# EasyEDA Pro project ProPrj_agronet_2025-02-23.epro

# Schematic Schematic1
Board Name: Board1; Create Date: 2024-12-03; Page Name: P1; Project Name: agronet; Schematic Name: Schematic1; Update Date: 2024-12-12; Company: Roxcode; Drawn: Ulisses Maffazioli; Page Size: A4; Part Number: ROX-001; Reviewed: Ulisses Maffazioli; Version: V0.1
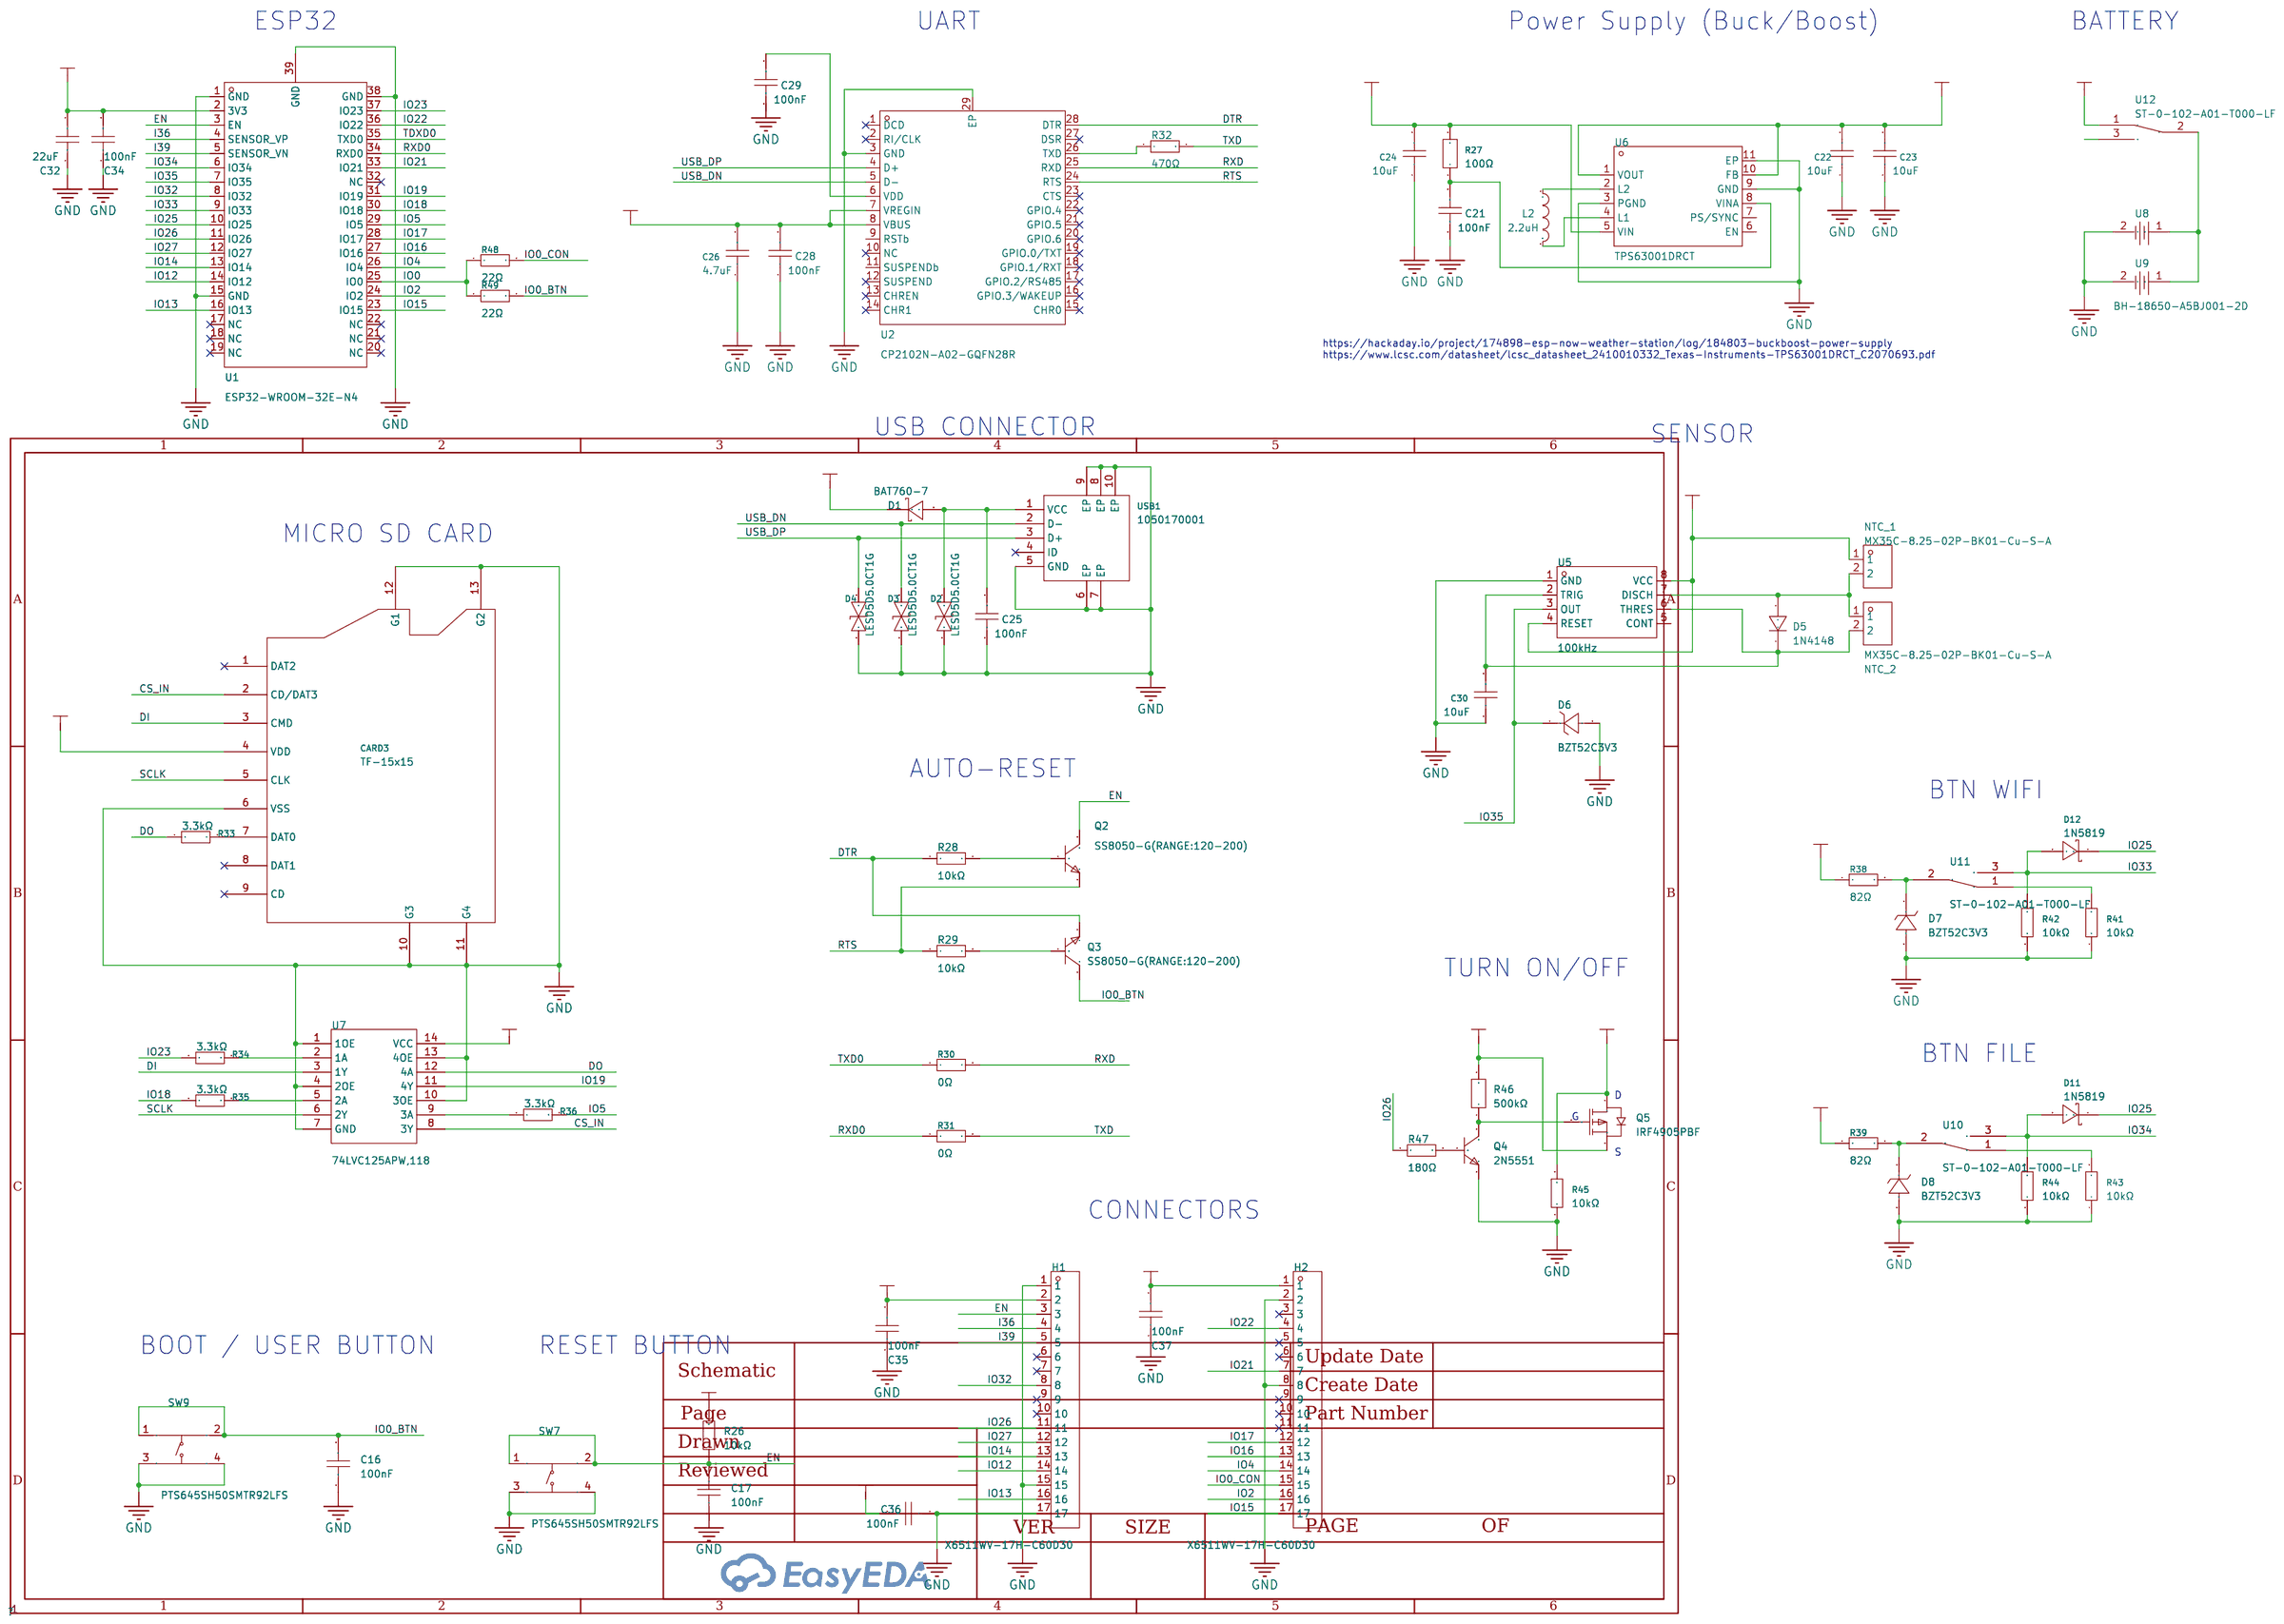
[diagram p0: schematic sheet]

## Parts
C16  100nF  [C0402]
C17  100nF  [C0402]
C21  100nF  [C0402]
C22  10uF  [C0603]
C23  10uF  [C0603]
C24  10uF  [C0603]
C25  100nF  [C0402]
C26  4.7uF  [C0402]
C28  100nF  [C0402]
C29  100nF  [C0402]
C30  10uF  [C0603]
C32  22uF  [C0805]
C34  100nF  [C0402]
C35  100nF  [C0402]
C36  100nF  [C0402]
C37  100nF  [C0402]
CARD3  TF-15x15  [TF-SMD_TF-15-15]
D1  BAT760-7  [SOD-323_L1.8-W1.3-LS2.5-RD]
D2  LESD5D5.0CT1G  [SOD-523_L1.2-W0.8-LS1.6-BI]
D3  LESD5D5.0CT1G  [SOD-523_L1.2-W0.8-LS1.6-BI]
D4  LESD5D5.0CT1G  [SOD-523_L1.2-W0.8-LS1.6-BI]
D5  1N4148  [DO-35_BD2.0-L4.0-P8.0-D0.5-RD]
D6  BZT52C3V3  [SOD-123_L2.7-W1.6-LS3.7-RD]
D7  BZT52C3V3  [SOD-123_L2.7-W1.6-LS3.7-RD]
D8  BZT52C3V3  [SOD-123_L2.7-W1.6-LS3.7-RD]
D11  1N5819  [DO-41_BD2.4-L4.7-P8.70-D0.9-RD]
D12  1N5819  [DO-41_BD2.4-L4.7-P8.70-D0.9-RD]
H1  X6511WV-17H-C60D30  [HDR-TH_17P-P2.54-V-M]
H2  X6511WV-17H-C60D30  [HDR-TH_17P-P2.54-V-M]
L2  2.2uH  [L1008]
NTC_1  MX35C-8.25-02P-BK01-Cu-S-A  [CONN-TH_MX35C-8.25-02P-BK01-CU-S-A]
NTC_2  MX35C-8.25-02P-BK01-Cu-S-A  [CONN-TH_MX35C-8.25-02P-BK01-CU-S-A]
Q2  SS8050-G(RANGE:120-200)  [SOT-23-3_L2.9-W1.3-P1.90-LS2.4-BR]
Q3  SS8050-G(RANGE:120-200)  [SOT-23-3_L2.9-W1.3-P1.90-LS2.4-BR]
Q4  2N5551  [TO-92-3_L4.5-W3.5-P1.27-L]
Q5  IRF4905PBF  [TO-220-3_L10.0-W4.5-P2.54-T]
R26  10kΩ  [R0402]
R27  100Ω  [R0402]
R28  10kΩ  [R0402]
R29  10kΩ  [R0402]
R30  0Ω  [R0402]
R31  0Ω  [R0402]
R32  470Ω  [R0603]
R33  3.3kΩ  [R0402]
R34  3.3kΩ  [R0402]
R35  3.3kΩ  [R0402]
R36  3.3kΩ  [R0402]
R38  82Ω  [R0402]
R39  82Ω  [R0402]
R41  10kΩ  [R0805]
R42  10kΩ  [R0805]
R43  10kΩ  [R0805]
R44  10kΩ  [R0805]
R45  10kΩ  [R0805]
R46  500kΩ  [R0603]
R47  180Ω  [R0603]
R48  22Ω  [R0402]
R49  22Ω  [R0402]
SW7  PTS645SH50SMTR92LFS  [KEY-SMD_4P-L6.0-W6.0-P4.50-LS9.0]
SW9  PTS645SH50SMTR92LFS  [KEY-SMD_4P-L6.0-W6.0-P4.50-LS9.0]
U1  ESP32-WROOM-32E-N4  [WIFI-SMD_ESP32-WROOM-32E]
U2  CP2102N-A02-GQFN28R  [QFN-28_L5.0-W5.0-P0.50-TL-EP3.3]
U5  100kHz  [DIP-8_L9.8-W6.6-P2.54-LS7.6-BL]
U6  TPS63001DRCT  [VSON-10_L3.0-W3.0-P0.50-TL-EP]
U7  74LVC125APW,118  [TSSOP-14_L5.0-W4.4-P0.65-LS6.4-BL]
U8  BH-18650-A5BJ001-2D  [BAT-TH_BH-18650-A5BJ001-2D]
U9  BH-18650-A5BJ001-2D  [BAT-TH_BH-18650-A5BJ001-2D]
U10  ST-0-102-A01-T000-LF  [SW-TH_3P-L8.3-W5.2-P2.54_ST-0-102-A01-T000]
U11  ST-0-102-A01-T000-LF  [SW-TH_3P-L8.3-W5.2-P2.54_ST-0-102-A01-T000]
U12  ST-0-102-A01-T000-LF  [SW-TH_3P-L8.3-W5.2-P2.54_ST-0-102-A01-T000]
USB1  1050170001  [MICRO-USB-SMD_105017-0001]

## Library data of the parts
C16 C17 C21 C25 C28 C29 C34-C37 = CL05B104KO5NNNC: Capacitance: Tolerance:±10% Tolerance:±10% Voltage Rated: Temperature Coefficient:; LCSC Part Name: 100nF ±10% 16V; Supplier Part: C1525; Manufacturer: SAMSUNG(三星); Supplier Footprint: 0402; JLCPCB Part Class: Basic Part; Datasheet: https://atta.szlcsc.com/upload/public/pdf/source/20160218/1457707763339.pdf; Supplier: LCSC; Tolerance: ±10%
C22-C24 C30 = CL10A106MQ8NNNC: Capacitance: Tolerance:±20% Tolerance:±20% Voltage Rated: Temperature Coefficient:; LCSC Part Name: 10uF ±20% 6.3V; Supplier Part: C1691; Manufacturer: SAMSUNG(三星); Supplier Footprint: 0603; JLCPCB Part Class: Extended Part; Datasheet: https://atta.szlcsc.com/upload/public/pdf/source/20160218/1457707763339.pdf; Supplier: LCSC; Tolerance: ±20%
C26 = CL05A475KP5NRNC: Capacitance: Tolerance:±10% Tolerance:±10% Voltage Rated: Temperature Coefficient:; LCSC Part Name: 4.7uF ±10% 10V; Supplier Part: C368809; Manufacturer: SAMSUNG(三星); Supplier Footprint: 0402; Datasheet: https://atta.szlcsc.com/upload/public/pdf/source/20160218/1457707763339.pdf; Supplier: LCSC; Tolerance: ±10%
C32 = CL21A226MAYNNNE: Capacitance: Tolerance:±20% Tolerance:±20% Voltage Rated: Temperature Coefficient:; LCSC Part Name: 22uF ±20% 25V; Supplier Part: C602037; Manufacturer: SAMSUNG(三星); Supplier Footprint: 0805; Datasheet: https://atta.szlcsc.com/upload/public/pdf/source/20200609/C602037_1A0D619693E608A1BF6E80154254E2DB.pdf; Supplier: LCSC; Tolerance: ±20%
CARD3 = TF-15x15: Card Connection Mode:Self bomb Card Type:MicroSD卡(TF卡) Connector Type:Deck Maximum Body Height:- Contact Material:- Contact Plating:- Operating Temperature Range:- Operating Temperature Range:- Soldering Temperature(Max):-; LCSC Part Name: 自弹式 MicroSD卡(TF卡) 卡座; Supplier Part: C111196; Manufacturer: SOFNG(硕方); Supplier Footprint: SMD; Datasheet: https://atta.szlcsc.com/upload/public/pdf/source/20200911/C111196_6985EA70490FD8F56A5C3F4D017F3786.pdf; Supplier: LCSC; Card Connection Mode: Self bomb; Card Type: MicroSD卡(TF卡); Connector Type: Deck
D1 = BAT760-7: Forward Voltage (Vf@If):550mV@1A Reverse Voltage (Vr):30V Rectified Current:1A Reverse Leakage Current (Ir):50uA@15V; LCSC Part Name: 电压:30V 电流:1A; Supplier Part: C124187; Manufacturer: DIODES(美台); Supplier Footprint: SOD-323; Datasheet: https://atta.szlcsc.com/upload/public/pdf/source/20171023/C124187_15087452555971052319.pdf; Supplier: LCSC; Forward Voltage (Vf@If): 550mV@1A; Reverse Voltage (Vr): 30V; Rectified Current: 1A; Reverse Leakage Current (Ir): 50uA@15V
D2-D4 = LESD5D5.0CT1G: polarity:Bi-Directional Reverse Stand-Off Voltage (Vrwm):5V Maximum Clamping Voltage:18.6V Peak Pulse Current (Ipp)@10/1000us:9.4A Breakdown Voltage:5.6V Type:ESD; LCSC Part Name: 双向ESD; Supplier Part: C383211; Manufacturer: LRC(乐山无线电); Supplier Footprint: SOD-523; JLCPCB Part Class: Extended Part; Datasheet: https://atta.szlcsc.com/upload/public/pdf/source/20190807/C383211_633DF4B4E2C161403226E5235FE33A1C.pdf; Supplier: LCSC; polarity: Bi-Directional; Reverse Stand-Off Voltage (Vrwm): 5V; Maximum Clamping Voltage: 18.6V; Peak Pulse Current (Ipp)@10/1000us: 9.4A; Breakdown Voltage: 5.6V; Type: ESD
D5 = 1N4148: Diode Configuration: Forward Voltage (Vf@If):- Reverse Voltage (Vr):- Average Rectified Current (Io):- Reverse Leakage Current:-; Supplier Part: C13769; Supplier Footprint: DO-35; Supplier: LCSC
D6-D8 = BZT52C3V3_1: Zener Voltage (Nom):3.3V Power Dissipation:350mW; Supplier Part: C5805693; Manufacturer: XZT(信展通); Supplier Footprint: SOD-123; JLCPCB Part Class: Extended Part; Datasheet: https://atta.szlcsc.com/upload/public/pdf/source/20230629/5B797ABAA38694813CD10E892227B1D3.pdf; Supplier: LCSC; Zener Voltage (Nom): 3.3V; Power Dissipation: 350mW
D11 D12 = 1N5819_C84620: Forward Voltage (Vf@If):600mV@1A Reverse Voltage (Vr):40V Average Rectified Current (Io):1A; LCSC Part Name: 电压:40V 电流:1A; Supplier Part: C84620; Manufacturer: 星海; Supplier Footprint: DO-41; JLCPCB Part Class: Extended Part; Datasheet: https://atta.szlcsc.com/upload/public/pdf/source/20161024/1477288663382.pdf; Supplier: LCSC; Forward Voltage (Vf@If): 600mV@1A; Reverse Voltage (Vr): 40V; Average Rectified Current (Io): 1A
H1 H2 = X6511WV-17H-C60D30: Pin Structure:1x17P Pitch:2.54mm Row Spacing:2.54mm Circluar Pins/Square Pins:Square Pins Mounting Type:- Number of Rows:Plugin Number of Pins:17P Current Rating (Max):3A Voltage Rating (Max):250V Length of Mating Pin:- Insulation Height:2.5mm Length of E; LCSC Part Name: 1x17P 间距:2.54mm 方针; Supplier Part: C725949; Manufacturer: XKB Connection(中国星坤); Supplier Footprint: 插件,P=2.54mm; JLCPCB Part Class: Extended Part; Datasheet: https://atta.szlcsc.com/upload/public/pdf/source/20211009/D19569EFFEB9776B42364DF7D41FD96A.pdf; Supplier: LCSC; Pin Structure: 1x17P; Pitch: 2.54mm; Row Spacing: 2.54mm; Circluar Pins/Square Pins: Square Pins; Number of Rows: Plugin; Number of Pins: 17P; Current Rating (Max): 3A; Voltage Rating (Max): 250V; Insulation Height: 2.5mm; Contact Plating: Gold; Operating Temperature Range: -40℃~+105℃; Soldering Temperature(Max): 260℃; Color: Black
L2 = LQM2HPN2R2MG0L: Inductance: Tolerance:±20% Tolerance:±20% Rated Current: Saturation Current (Isat):- DC Resistance (DCR): Q @ Freq:- Frequency - Self Resonant: Ratings:; LCSC Part Name: 2.2uH ±20%; Supplier Part: C86092; Manufacturer: muRata(村田); Supplier Footprint: 1008; Datasheet: https://atta.szlcsc.com/upload/public/pdf/source/20180326/C86092_9C29A1E2AA95AB1022CF7FBF5DEEB894.pdf; Supplier: LCSC; Tolerance: ±20%
NTC_1 NTC_2 = MX35C-8.25-02P-BK01-Cu-S-A: Barrier Type:Double-sided Pitch:8.25mm Structure:1x2P Mounting Style:Straight Needle Pin Location:Mid Leg Number of Pins:2P Number of Rows:1 Number of PINs Per Row:2 Screw Specification:M3 Current Rating (Max):20A Voltage Rating (Max):300V Wire Gauge - AW; LCSC Part Name: 8.25mm 1x2P 直针 中脚 排数:1 每排P数:2; Supplier Part: C5290385; Manufacturer: MAX(迈旭); Supplier Footprint: 插件,P=8.25mm; JLCPCB Part Class: Extended Part; Datasheet: https://atta.szlcsc.com/upload/public/pdf/source/20230914/8F462108BB3B701A6F52F73F1C3AF090.pdf; Supplier: LCSC; Barrier Type: Double-sided; Pitch: 8.25mm; Structure: 1x2P; Mounting Style: Straight Needle; Pin Location: Mid Leg; Number of Pins: 2P; Number of Rows: 1; Number of PINs Per Row: 2; Screw Specification: M3; Current Rating (Max): 20A; Voltage Rating (Max): 300V; Wire Gauge - AWG: 12~22; Wire Gauge - mm2: 2.5; Operating Temperature Range: -40℃~+105℃; Color: Black
Q2 Q3 = SS8050-G(RANGE:120-200): Transistor Type: Collector Current (Ic): Collector-Emitter Breakdown Voltage (Vceo): Power Dissipation (Pd): DC Current Gain (hFE@Ic,Vce):120@100mA,1V DC Current Gain (hFE@Ic,Vce):120@100mA,1V Transition Frequency (fT):100MHz Collector Cut-Off Current (Ic; LCSC Part Name: NPN 电流:1.5A 耐压:25V L档(120-200); Supplier Part: C164886; Manufacturer: CJ(江苏长电/长晶); Supplier Footprint: SOT-23; JLCPCB Part Class: Extended Part; Datasheet: https://atta.szlcsc.com/upload/public/pdf/source/20180130/C177739_15172974524031323483.pdf; Supplier: LCSC; DC Current Gain (hFE@Ic,Vce): 120@100mA,1V; Transition Frequency (fT): 100MHz; Collector Cut-Off Current (Icbo): 100nA; Collector-Emitter Saturation Voltage (VCE(sat)@Ic,Ib): 500mV@800mA,80mA; Operating Temperature: -55℃~+150℃
Q4 = 2N5551: Transistor Type: Collector Current (Ic):600mA Collector-Emitter Breakdown Voltage (Vceo): Power Dissipation (Pd): DC Current Gain (hFE@Ic,Vce):80@10mA,5V DC Current Gain (hFE@Ic,Vce):80@10mA,5V Transition Frequency (fT):100MHz Collector Cut-Off Current (I; LCSC Part Name: NPN 电流:600mA 耐压:160V; Supplier Part: C2936034; Manufacturer: Slkor(萨科微); Supplier Footprint: TO-92-3; Datasheet: https://atta.szlcsc.com/upload/public/pdf/source/20211223/6A0B10C6CED69DC3DE22C5E0F389F525.pdf; Supplier: LCSC; Collector Current (Ic): 600mA; DC Current Gain (hFE@Ic,Vce): 80@10mA,5V; Transition Frequency (fT): 100MHz; Collector Cut-Off Current (Icbo): 50nA; Collector-Emitter Saturation Voltage (VCE(sat)@Ic,Ib): 200mV@50mA,5mA
Q5 = IRF4905PBF: Type:1 Piece P-Channel Drain Source Voltage (Vdss): Continuous Drain Current (Id): Drain Source On Resistance (RDS(on)@Vgs,Id):0.02Ω@10V,38A Power Dissipation (Pd): Gate Threshold Voltage (Vgs(th)@Id):2V@250uA Total Gate Charge (Qg@Vgs):180nC@10V Input Ca; LCSC Part Name: 1个P沟道 耐压:55V 电流:74A; Supplier Part: C2564; Manufacturer: Infineon(英飞凌); Supplier Footprint: TO-220AB; JLCPCB Part Class: Extended Part; Datasheet: https://atta.szlcsc.com/upload/public/pdf/source/20140818/1457707225921.pdf; Supplier: LCSC; Type: 1 Piece P-Channel; Drain Source On Resistance (RDS(on)@Vgs,Id): 0.02Ω@10V,38A; Gate Threshold Voltage (Vgs(th)@Id): 2V@250uA; Total Gate Charge (Qg@Vgs): 180nC@10V; Input Capacitance (Ciss@Vds): 3.4nF; Reverse Transfer Capacitance (Crss@Vds): 640pF; Operating Temperature: -55℃~+175℃
R26 R28 R29 = 0402WGF1002TCE: Type:Thick Film Resistors Resistance:10kΩ Tolerance:±1% Tolerance:±1% Power(Watts): Overload Voltage (Max): Temperature Coefficient:±100ppm/℃ Temperature Coefficient:±100ppm/℃ Operating Temperature Range:-55℃~+155℃ Operating Temperature Range:-55℃~+155℃; LCSC Part Name: 10kΩ ±1% 62.5mW 厚膜电阻; Supplier Part: C25744; Manufacturer: UNI-ROYAL(厚声); Supplier Footprint: 0402; JLCPCB Part Class: Basic Part; Datasheet: https://atta.szlcsc.com/upload/public/pdf/source/20200306/C422600_1E6D84923E4A46A82E41ADD87F860B5C.pdf; Supplier: LCSC; Type: Thick Film Resistors; Tolerance: ±1%; Temperature Coefficient: ±100ppm/℃; Operating Temperature Range: -55℃~+155℃
R27 = TC0250B1000TCC: Type:Thin Film Resistor Resistance: Tolerance:±0.1% Tolerance:±0.1% Power(Watts): Overload Voltage (Max): Temperature Coefficient:±50ppm/℃ Temperature Coefficient:±50ppm/℃; LCSC Part Name: 100Ω ±0.1% 62.5mW 薄膜电阻; Supplier Part: C517517; Manufacturer: UNI-ROYAL(厚声); Supplier Footprint: 0402; JLCPCB Part Class: Extended Part; Datasheet: https://atta.szlcsc.com/upload/public/pdf/source/20200423/C516826_F020E15F12DC1CC4D2066749A2400ECB.pdf; Supplier: LCSC; Type: Thin Film Resistor; Tolerance: ±0.1%; Temperature Coefficient: ±50ppm/℃
R30 R31 = 0402WGF0000TCE: Type:Thick Film Resistors Resistance: Tolerance:±1% Tolerance:±1% Power(Watts): Overload Voltage (Max): Temperature Coefficient:±800ppm/℃ Temperature Coefficient:±800ppm/℃ Operating Temperature Range:-55℃~+155℃ Operating Temperature Range:-55℃~+155℃; LCSC Part Name: 0Ω ±1% 62.5mW 厚膜电阻; Supplier Part: C17168; Manufacturer: UNI-ROYAL(厚声); Supplier Footprint: 0402; JLCPCB Part Class: Basic Part; Datasheet: https://atta.szlcsc.com/upload/public/pdf/source/20200306/C422600_1E6D84923E4A46A82E41ADD87F860B5C.pdf; Supplier: LCSC; Type: Thick Film Resistors; Tolerance: ±1%; Temperature Coefficient: ±800ppm/℃; Operating Temperature Range: -55℃~+155℃
R32 = 0603WAF4700T5E: Type:Thick Film Resistors Resistance: Tolerance:±1% Tolerance:±1% Power(Watts): Overload Voltage (Max): Temperature Coefficient:±100ppm/℃ Temperature Coefficient:±100ppm/℃ Operating Temperature Range:-55℃~+155℃ Operating Temperature Range:-55℃~+155℃; LCSC Part Name: 470Ω ±1% 100mW 厚膜电阻; Supplier Part: C23179; Manufacturer: UNI-ROYAL(厚声); Supplier Footprint: 0603; Datasheet: https://atta.szlcsc.com/upload/public/pdf/source/20200306/C422600_1E6D84923E4A46A82E41ADD87F860B5C.pdf; Supplier: LCSC; Type: Thick Film Resistors; Tolerance: ±1%; Temperature Coefficient: ±100ppm/℃; Operating Temperature Range: -55℃~+155℃
R33-R36 = 0402WGF3301TCE: Type:Thick Film Resistors Resistance:3.3kΩ Tolerance:±1% Tolerance:±1% Power(Watts): Overload Voltage (Max): Temperature Coefficient:±100ppm/℃ Temperature Coefficient:±100ppm/℃ Operating Temperature Range:-55℃~+155℃ Operating Temperature Range:-55℃~+155℃; LCSC Part Name: 3.3kΩ ±1% 62.5mW 厚膜电阻; Supplier Part: C25890; Manufacturer: UNI-ROYAL(厚声); Supplier Footprint: 0402; Datasheet: https://atta.szlcsc.com/upload/public/pdf/source/20200306/C422600_1E6D84923E4A46A82E41ADD87F860B5C.pdf; Supplier: LCSC; Type: Thick Film Resistors; Tolerance: ±1%; Temperature Coefficient: ±100ppm/℃; Operating Temperature Range: -55℃~+155℃
R38 R39 = 0402WGF820JTCE: Type:Thick Film Resistors Resistance:82Ω Tolerance:±1% Tolerance:±1% Power(Watts): Overload Voltage (Max): Temperature Coefficient:±200ppm/℃ Temperature Coefficient:±200ppm/℃ Operating Temperature Range:-55℃~+155℃ Operating Temperature Range:-55℃~+155℃; LCSC Part Name: 82Ω ±1% 62.5mW 厚膜电阻; Supplier Part: C25136; Manufacturer: UNI-ROYAL(厚声); Supplier Footprint: 0402; JLCPCB Part Class: Extended Part; Datasheet: https://atta.szlcsc.com/upload/public/pdf/source/20200306/C422600_1E6D84923E4A46A82E41ADD87F860B5C.pdf; Supplier: LCSC; Type: Thick Film Resistors; Tolerance: ±1%; Temperature Coefficient: ±200ppm/℃; Operating Temperature Range: -55℃~+155℃
R41-R45 = 0805W8F1002T5E: Type:Thick Film Resistors Resistance:10kΩ Tolerance:±1% Tolerance:±1% Power(Watts): Overload Voltage (Max): Temperature Coefficient:±100ppm/℃ Temperature Coefficient:±100ppm/℃ Operating Temperature Range:-55℃~+155℃ Operating Temperature Range:-55℃~+155℃; LCSC Part Name: 10kΩ ±1% 125mW 厚膜电阻; Supplier Part: C17414; Manufacturer: UNI-ROYAL(厚声); Supplier Footprint: 0805; Datasheet: https://atta.szlcsc.com/upload/public/pdf/source/20200306/C422600_1E6D84923E4A46A82E41ADD87F860B5C.pdf; Supplier: LCSC; Type: Thick Film Resistors; Tolerance: ±1%; Temperature Coefficient: ±100ppm/℃; Operating Temperature Range: -55℃~+155℃
R46 = AR03BTCX5003N: Type:Thin Film Resistor Resistance: Tolerance:±0.1% Tolerance:±0.1% Power(Watts): Overload Voltage (Max): Temperature Coefficient:±25ppm/℃ Temperature Coefficient:±25ppm/℃ Operating Temperature Range:-55℃~+155℃ Operating Temperature Range:-55℃~+155℃; LCSC Part Name: 薄膜电阻 500kΩ ±0.1% 100mW; Supplier Part: C2902631; Manufacturer: Viking(光颉); Supplier Footprint: 0603; Datasheet: https://atta.szlcsc.com/upload/public/pdf/source/20191129/C465721_10D49275DB41E427863CE9C8D788770A.pdf; Supplier: LCSC; Type: Thin Film Resistor; Tolerance: ±0.1%; Temperature Coefficient: ±25ppm/℃; Operating Temperature Range: -55℃~+155℃
R47 = 0603WAF1800T5E: Type:Thick Film Resistors Resistance: Tolerance:±1% Tolerance:±1% Power(Watts): Overload Voltage (Max): Temperature Coefficient:±100ppm/℃ Temperature Coefficient:±100ppm/℃ Operating Temperature Range:-55℃~+155℃ Operating Temperature Range:-55℃~+155℃; LCSC Part Name: 180Ω ±1% 100mW 厚膜电阻; Supplier Part: C22828; Manufacturer: UNI-ROYAL(厚声); Supplier Footprint: 0603; Datasheet: https://atta.szlcsc.com/upload/public/pdf/source/20200306/C422600_1E6D84923E4A46A82E41ADD87F860B5C.pdf; Supplier: LCSC; Type: Thick Film Resistors; Tolerance: ±1%; Temperature Coefficient: ±100ppm/℃; Operating Temperature Range: -55℃~+155℃
R48 R49 = 0402WGF220JTCE: Type:Thick Film Resistors Resistance:22Ω Tolerance:±1% Tolerance:±1% Power(Watts): Overload Voltage (Max): Temperature Coefficient:±100ppm/℃ Temperature Coefficient:±100ppm/℃ Operating Temperature Range:-55℃~+155℃ Operating Temperature Range:-55℃~+155℃; LCSC Part Name: 22Ω ±1% 62.5mW 厚膜电阻; Supplier Part: C25092; Manufacturer: UNI-ROYAL(厚声); Supplier Footprint: 0402; Datasheet: https://atta.szlcsc.com/upload/public/pdf/source/20200306/C422600_1E6D84923E4A46A82E41ADD87F860B5C.pdf; Supplier: LCSC; Type: Thick Film Resistors; Tolerance: ±1%; Temperature Coefficient: ±100ppm/℃; Operating Temperature Range: -55℃~+155℃
SW7 SW9 = PTS645SH50SMTR92LFS: Circuit:SPST Actuator Style:Round Button Operating Force:200gf Mounting Style:Standing paste Switch Length:6mm Switch Width:6mm Switch Height:5mm Contact Current:50mA Voltage Rating (DC):12V With Lamp:- Pin Style:Gullwing Mechanical Life:- Operating Tempe; LCSC Part Name: 6*6*5mm 立贴 轻触开关; Supplier Part: C221869; Manufacturer: C&K; Supplier Footprint: SMD,6x6mm; JLCPCB Part Class: Extended Part; Datasheet: https://atta.szlcsc.com/upload/public/pdf/source/20190108/C285530_E89B379DE8DD14E424006A6061D0203A.pdf; Supplier: LCSC; Circuit: SPST; Actuator Style: Round Button; Operating Force: 200gf; Mounting Style: Standing paste; Switch Length: 6mm; Switch Width: 6mm; Switch Height: 5mm; Contact Current: 50mA; Voltage Rating (DC): 12V; Pin Style: Gullwing; Operating Temperature: -40℃~+85℃
U1 = ESP32-WROOM-32E-N4: LCSC Part Name: 通用型Wi-Fi+BT+BLE MCU模组; Supplier Part: C701341; Manufacturer: ESPRESSIF(乐鑫); Supplier Footprint: SMD,18x25.5mm; Datasheet: https://atta.szlcsc.com/upload/public/pdf/source/20220601/0020821B65DE5740BBACA5FACC5CF3B6.pdf; Supplier: LCSC
U2 = CP2102N-A02-GQFN28R: Applications Function:USB to UART Protocol: Supply Voltage:3V~3.6V Supply Voltage:3V~3.6V Operating Temperature:-40℃~+85℃@(Ta) Operating Temperature:-40℃~+85℃@(Ta); LCSC Part Name: USB 2.0全速功能控制器，USB收发器，振荡器和通用异步接收机/发射机(UART); Supplier Part: C964632; Manufacturer: SKYWORKS/SILICON LABS(芯科); Supplier Footprint: QFN-28-EP(5x5); JLCPCB Part Class: Extended Part; Datasheet: https://atta.szlcsc.com/upload/public/pdf/source/20201204/C964632_F2B790CC23A72455AEF523510305B30A.pdf; Supplier: LCSC; Applications Function: USB to UART; Supply Voltage: 3V~3.6V; Operating Temperature: -40℃~+85℃@(Ta)
U5 = NE555P: Frequency:100kHz Supply Voltage:4.5V~16V Supply Voltage:4.5V~16V Supply Current:10mA Operating Temperature:0℃~+70℃ Operating Temperature:0℃~+70℃; Supplier Part: C46749; Manufacturer: TI(德州仪器); Supplier Footprint: DIP-8; Datasheet: https://www.ti.com/cn/lit/gpn/ne555; Supplier: LCSC; Supply Voltage: 4.5V~16V; Supply Current: 10mA; Operating Temperature: 0℃~+70℃
U6 = TPS63001DRCT: Function:Boost type Output Type:Fixed Input Voltage:1.8V~5.5V Input Voltage:1.8V~5.5V Output Voltage:3.3V Output Voltage:3.3V Output Current:1.6A Switching Frequency:1.5MHz Switching Frequency:1.5MHz Operating Temperature:-40℃~+85℃@(TA) Operating Temperat; LCSC Part Name: TPS6300x 高效单电感降压-升压转换器; Supplier Part: C2070693; Manufacturer: TI(德州仪器); Supplier Footprint: VSON-10-EP(3x3); JLCPCB Part Class: Extended Part; Datasheet: https://www.ti.com/cn/lit/gpn/tps63000; Supplier: LCSC; Function: Boost type; Output Type: Fixed; Input Voltage: 1.8V~5.5V; Output Voltage: 3.3V; Output Current: 1.6A; Switching Frequency: 1.5MHz; Operating Temperature: -40℃~+85℃@(TA); Synchronous Rectification: Yes; Number of Outputs: 1; Topology: Step-down-Boost; Switch tube (built-in/external): Built-in
U7 = 74LVC125APW,118: output type:Tri-State Supply Voltage:1.2V~3.6V Supply Voltage:1.2V~3.6V Number of Elements:4 Number of Bits per Element:1 Sink Current:24mA Source Current:24mA Logic Family:74LVC Operating Temperature:-40℃~+125℃ Operating Temperature:-40℃~+125℃; Supplier Part: C6059; Manufacturer: Nexperia(安世); Supplier Footprint: TSSOP-14; JLCPCB Part Class: Extended Part; Datasheet: https://atta.szlcsc.com/upload/public/pdf/source/20200702/C548083_7401241EC414E68B7416871F88F0FD1D.pdf; Supplier: LCSC; output type: Tri-State; Supply Voltage: 1.2V~3.6V; Number of Elements: 4; Number of Bits per Element: 1; Sink Current: 24mA; Source Current: 24mA; Logic Family: 74LVC; Operating Temperature: -40℃~+125℃
U8 U9 = BH-18650-A5BJ001-2D: Connector Type:Battery box Battery Type:- Contact Plating:Nickel Operating Temperature Range:-10℃~+100℃ Operating Temperature Range:-10℃~+100℃; LCSC Part Name: 电池盒; Supplier Part: C19184083; Manufacturer: MYOUNG(美阳); Supplier Footprint: 插件; JLCPCB Part Class: Extended Part; Datasheet: https://atta.szlcsc.com/upload/public/pdf/source/20231108/7CF586EC5DCFE5D582991176466319C5.pdf; Supplier: LCSC; Connector Type: Battery box; Contact Plating: Nickel; Operating Temperature Range: -10℃~+100℃
U10-U12 = ST-0-102-A01-T000-LF: Circuit:SPDT Switch Length:8.3mm Switch Width:5.2mm Switch Height:23.6mm Mechanical Life:- Contact Current:3A Voltage Rating (AC):125V Actuator Type:Cylindrical button handle Pin Style:Solder Lug Mounting Style:Straight Operating Temperature:-25℃~+85℃ Ope; LCSC Part Name: 超小型钮子三脚二档 五件套 含配件; Supplier Part: C1788487; Manufacturer: YUEN FUNG(源丰); Supplier Footprint: 插件; JLCPCB Part Class: Extended Part; Datasheet: https://atta.szlcsc.com/upload/public/pdf/source/20230720/31DDFEC61AC21D005BE18E754C3E93F0.pdf; Supplier: LCSC; Circuit: SPDT; Switch Length: 8.3mm; Switch Width: 5.2mm; Switch Height: 23.6mm; Contact Current: 3A; Voltage Rating (AC): 125V; Actuator Type: Cylindrical button handle; Pin Style: Solder Lug; Mounting Style: Straight; Operating Temperature: -25℃~+85℃
USB1 = 1050170001: Connector Type:Micro-B Standard:USB 2.0 Gender:Female Number of Ports:1 Number of Contacts:5P Mounting Style:卧贴 Current Rating - Power (Max):- Operating Temperature Range:-30℃~+85℃ Operating Temperature Range:-30℃~+85℃; LCSC Part Name: Micro-B 母 卧贴; Supplier Part: C136000; Manufacturer: MOLEX; Supplier Footprint: SMD; Datasheet: https://atta.szlcsc.com/upload/public/pdf/source/20171113/C136000_15105610884381115465.pdf; Supplier: LCSC; Connector Type: Micro-B; Standard: USB 2.0; Gender: Female; Number of Ports: 1; Number of Contacts: 5P; Mounting Style: 卧贴; Operating Temperature Range: -30℃~+85℃

## Nets
3V3: C22.2 C23.2 C32.2 C34.2 C35.2 C37.2 CARD3.4(VDD) H1.2 H2.1 R26.2 U1.2(3V3) U6.1(VOUT) U6.10(FB) U7.14(VCC)
GND: C16.1 C17.1 C21.1 C22.1 C23.1 C24.1 C25.1 C26.1 C28.1 C29.1 C30.1 C32.1 C34.1 C35.1 C36.1 C37.1 CARD3.6(VSS) CARD3.10(G3) CARD3.11(G4) CARD3.12(G1) CARD3.13(G2) D2.1 D3.1 D4.1 D6.2(A) D7.2(A) D8.2(A) H1.1 H1.15 H1.17 H2.2 H2.8 Q4.1(E) R41.1 R42.1 R43.1 R44.1 R45.1 SW7.3 SW7.4 SW9.3 SW9.4 U1.1(GND) U1.15(GND) U1.38(GND) U1.39(GND) U2.3(GND) U2.29(EP) U5.1(GND) U6.3(PGND) U6.9(GND) U6.11(EP) U7.1(1OE) U7.4(2OE) U7.7(GND) U7.10(3OE) U7.13(4OE) U8.2 U9.2 USB1.5(GND) USB1.6(EP) USB1.7(EP) USB1.8(EP) USB1.9(EP) USB1.10(EP)
VCC_555: NTC_1.1 Q5.2(D) R45.2 U5.4(RESET) U5.8(VCC)
VCC_BATTERY: C24.2 Q5.3(S) R27.2 R38.1 R39.1 R46.2 U6.5(VIN) U12.1
CS_IN: CARD3.2(CD/DAT3) U7.8(3Y)
DI: CARD3.3(CMD) U7.3(1Y)
DO: R33.1 U7.12(4A)
DTR: Q3.2(E) R28.1 U2.28(DTR)
EN: C17.2 H1.3 Q2.3(C) R26.1 SW7.1 SW7.2 U1.3(EN)
EXT_5V: C26.2 C28.2 C36.2 D1.1 U2.7(VREGIN) U2.8(VBUS)
I36: H1.4 U1.4(SENSOR_VP)
I39: H1.5 U1.5(SENSOR_VN)
IO0: R48.1 R49.1 U1.25(IO0)
IO0_BTN: C16.2 Q3.3(C) R49.2 SW9.1 SW9.2
IO0_CON: H2.15 R48.2
IO2: H2.16 U1.24(IO2)
IO4: H2.14 U1.26(IO4)
IO5: R36.2 U1.29(IO5)
IO12: H1.14 U1.14(IO12)
IO13: H1.16 U1.16(IO13)
IO14: H1.13 U1.13(IO14)
IO15: H2.17 U1.23(IO15)
IO16: H2.13 U1.27(IO16)
IO17: H2.12 U1.28(IO17)
IO18: R35.1 U1.30(IO18)
IO19: U1.31(IO19) U7.11(4Y)
IO21: H2.7 U1.33(IO21)
IO22: H2.4 U1.36(IO22)
IO23: R34.1 U1.37(IO23)
IO25: D11.1(C) D12.1(C) U1.10(IO25)
IO26: H1.11 R47.1 U1.11(IO26)
IO27: H1.12 U1.12(IO27)
IO32: H1.8 U1.8(IO32)
IO33: D12.2(A) R42.2 U1.9(IO33) U11.3
IO34: D11.2(A) R44.2 U1.6(IO34) U10.3
IO35: D6.1(K) U1.7(IO35) U5.3(OUT)
RTS: Q2.2(E) R29.1 U2.24(RTS)
RXD: R30.2 U2.25(RXD)
RXD0: R31.1 U1.34(RXD0)
SCLK: CARD3.5(CLK) U7.6(2Y)
TDXD0: U1.35(TXD0)
TXD: R31.2 R32.2
TXD0: R30.1
USB_DN: D3.2 U2.5(D-) USB1.2(D-)
USB_DP: D4.2 U2.4(D+) USB1.3(D+)
$1N2187: L2.1 U6.2(L2)
$1N2191: L2.2 U6.4(L1)
$1N2338: C21.2 R27.1 U6.8(VINA)
$1N2901: C25.2 D1.2 D2.2 USB1.1(VCC)
$1N3437: C29.2 U2.6(VDD)
$1N3704: R32.1 U2.26(TXD)
$1N4008: Q2.1(B) R28.2
$1N4012: Q3.1(B) R29.2
$1N5652: R34.2 U7.2(1A)
$1N5675: R35.2 U7.5(2A)
$1N5804: R36.1 U7.9(3A)
$1N6073: D5.2 NTC_1.2 NTC_2.1 U5.7(DISCH)
$1N6173: C30.2 D5.1 NTC_2.2 U5.2(TRIG) U5.6(THRES)
$1N6819: Q4.3(C) Q5.1(G) R46.1
$1N7033: D7.1(K) R38.2 U11.2
$1N7043: D8.1(K) R39.2 U10.2
$1N8176: R43.2 U10.1
$1N8251: R41.2 U11.1
$1N10367: CARD3.7(DAT0) R33.2
$1N11086: Q4.2(B) R47.2
$1N13989: U8.1 U9.1 U12.2

Not connected (* = marked no-connect by the designer): CARD3 1(DAT2)* 8(DAT1)* 9(CD)*; H1 6* 7* 9* 10*; H2 3* 5* 6* 9* 10* 11*; U1 17(NC)* 18(NC)* 19(NC)* 20(NC)* 21(NC)* 22(NC)* 32(NC)*; U2 1(DCD)* 2(RI/CLK)* 9(RSTb) 10(NC)* 11(SUSPENDb) 12(SUSPEND)* 13(CHREN)* 14(CHR1)* 15(CHR0)* 16(GPIO.3/WAKEUP)* 17(GPIO.2/RS485)* 18(GPIO.1/RXT)* 19(GPIO.0/TXT)* 20(GPIO.6)* 21(GPIO.5)* 22(GPIO.4)* 23(CTS)* 27(DSR)*; U5 5(CONT); U6 6(EN) 7(PS/SYNC); U12 3; USB1 4(ID)*

## Notes on the sheet
- ESP32
- UART
- Power Supply (Buck/Boost)
- BATTERY
- https://hackaday.io/project/174898-esp-now-weather-station/log/184803-buckboost-power-supply
  https://www.lcsc.com/datasheet/lcsc_datasheet_2410010332_Texas-Instruments-TPS63001DRCT_C2070693.pdf
- USB CONNECTOR
- SENSOR
- MICRO SD CARD
- AUTO-RESET
- BTN WIFI
- TURN ON/OFF
- BTN FILE
- D
- G
- S
- CONNECTORS
- BOOT / USER BUTTON
- RESET BUTTON

# Board PCB3
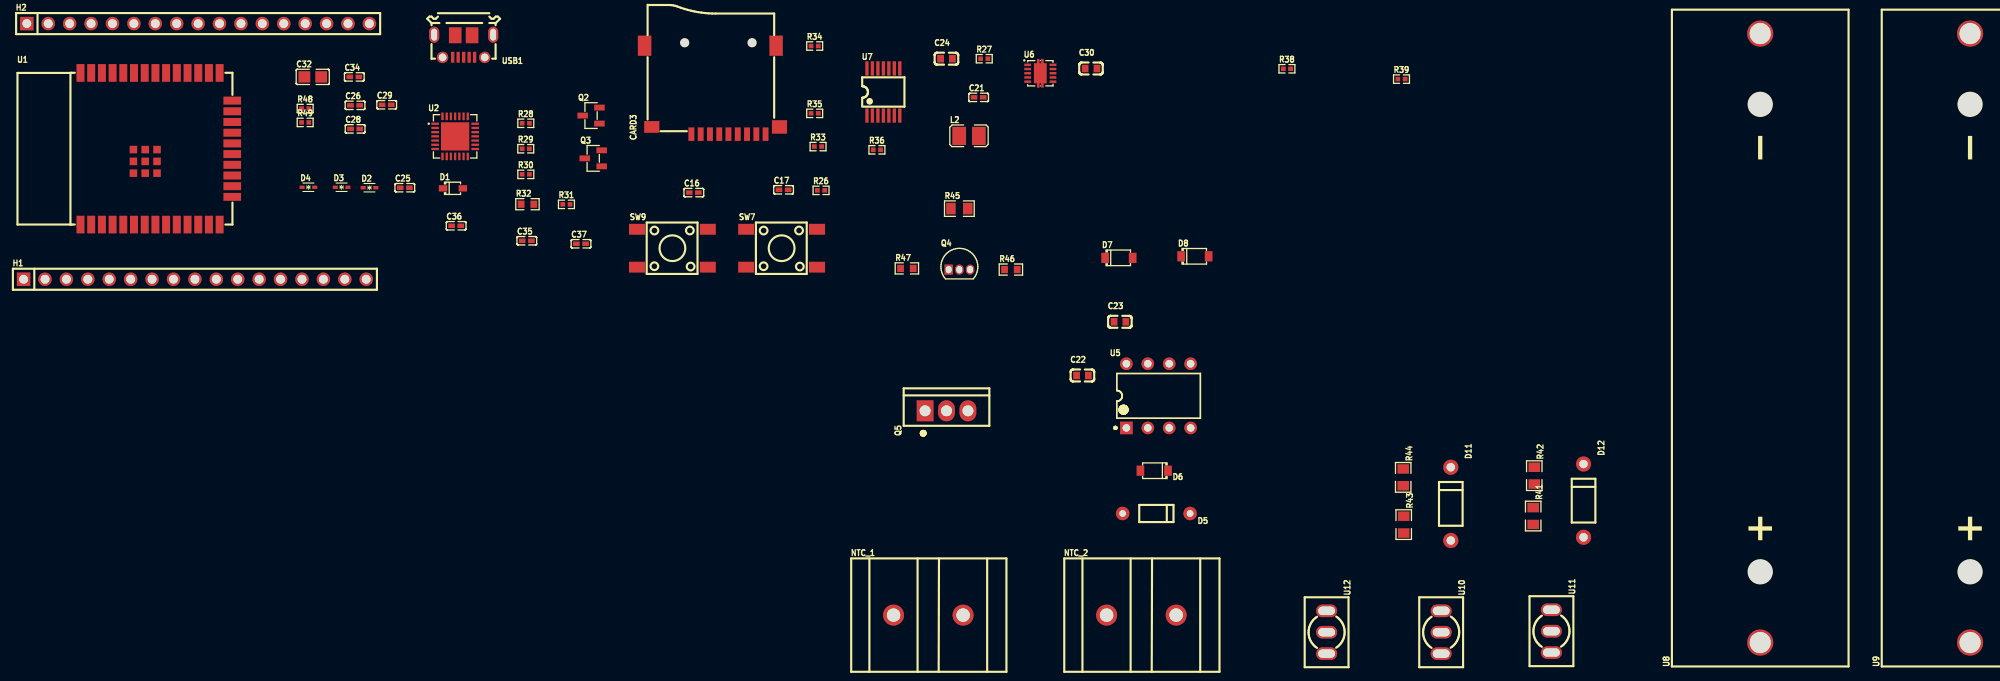
[diagram p1: board, top side]
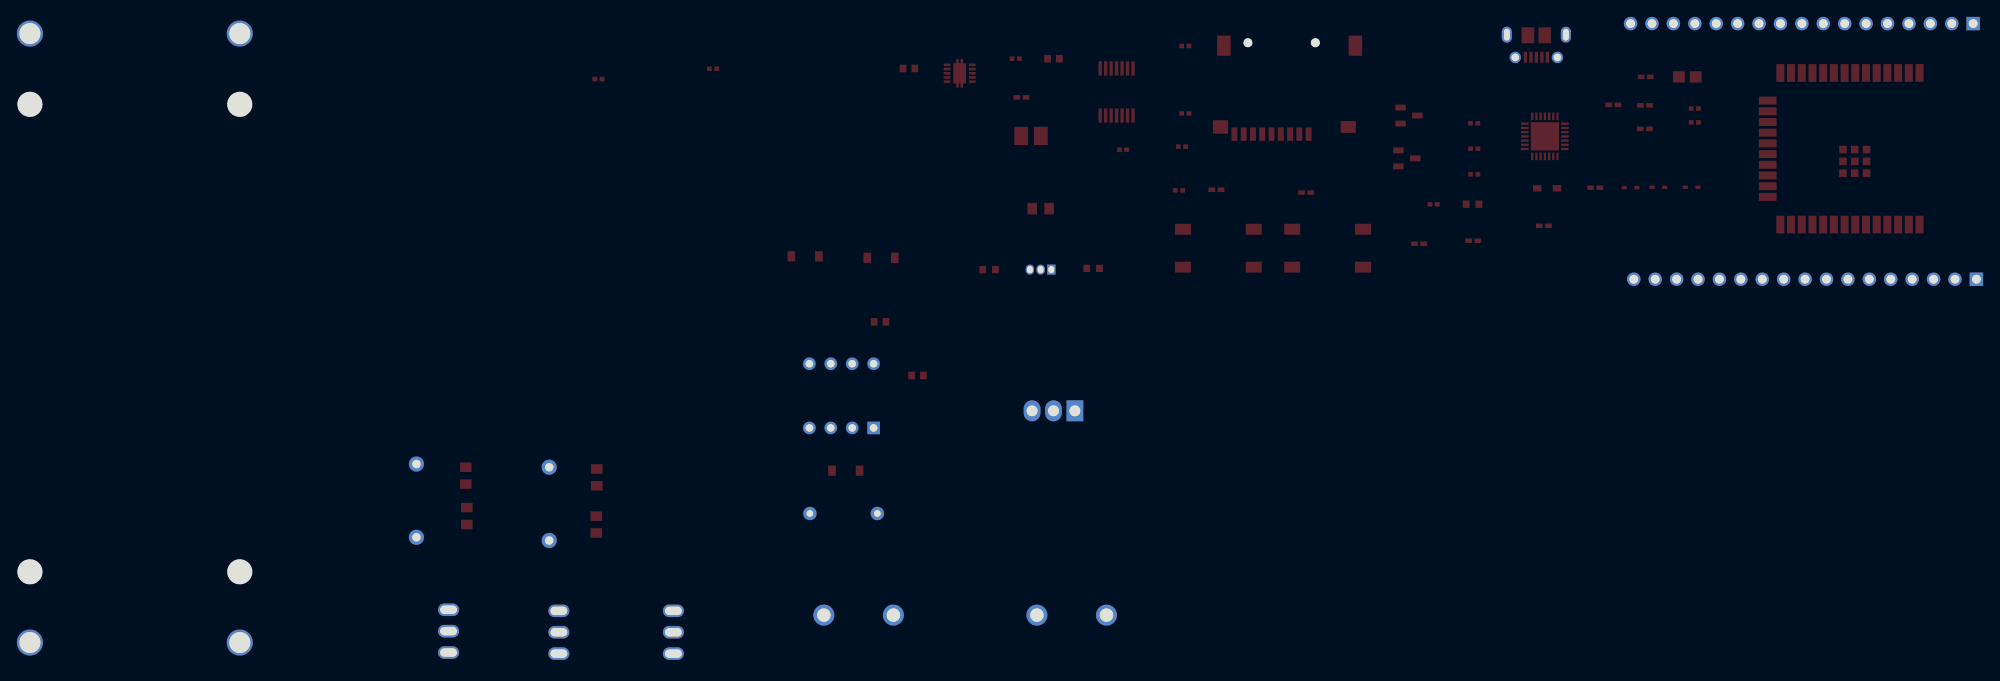
[diagram p2: board, bottom side, seen from below]

Outline 154.52 x 64.86 mm; copper layers: Top Layer, Bottom Layer. Coordinates in mm from the lower left corner of the outline.
Stack: Top Layer 0.035mm / Dielectric1 1.51mm FR4 er 4.5 / Bottom Layer 0.035mm

## Design rules (mm)
template: JLCPCB Capability(Two Layers Board)
spacing copperThickness1oz (default): track to track 0.102, other pairs 0.152 to 0.3
spacing copperThickness2oz: track to track 0.203, other pairs 0.152 to 0.3
track width copperThickness1oz (default): min 0.127, default 0.254, max 2.54
track width copperThickness2oz: min 0.203, default 0.254, max 2.54
differential pair differentialPair (default): width min 0.127, default 0.254, max 2.54; gap min 0.152, default 0.152
via viaSize (default): diameter min 0.5, default 0.61, max 10; hole min 0.3, default 0.305, max 6.3

## Placement (name value [footprint] x y rotation side)
C16  100nF  [C0402]  1.64 46.52 0 top
C17  100nF  [C0402]  12.28 46.85 0 top
C21  100nF  [C0402]  35.42 57.82 0 top
C22  10uF  [C0603]  47.74 24.8 0 top
C23  10uF  [C0603]  52.18 31.17 0 top
C24  10uF  [C0603]  31.61 62.41 0 top
C25  100nF  [C0402]  -32.65 47.1 0 top
C26  4.7uF  [C0402]  -38.55 56.88 0 top
C28  100nF  [C0402]  -38.54 54.08 0 top
C29  100nF  [C0402]  -34.8 56.94 0 top
C30  10uF  [C0603]  48.75 61.25 0 top
C32  22uF  [C0805]  -43.57 60.25 0 top
C34  100nF  [C0402]  -38.64 60.25 0 top
C35  100nF  [C0402]  -18.18 40.8 0 top
C36  100nF  [C0402]  -26.56 42.58 0 top
C37  100nF  [C0402]  -11.75 40.44 0 top
CARD3  TF-15x15  [TF-SMD_TF-15-15]  3.8 58.71 90 top
D1  BAT760-7  [SOD-323_L1.8-W1.3-LS2.5-RD]  -26.94 47.03 0 top
D2  LESD5D5.0CT1G  [SOD-523_L1.2-W0.8-LS1.6-BI]  -36.84 47.1 0 top
D3  LESD5D5.0CT1G  [SOD-523_L1.2-W0.8-LS1.6-BI]  -40.15 47.15 0 top
D4  LESD5D5.0CT1G  [SOD-523_L1.2-W0.8-LS1.6-BI]  -44.08 47.15 0 top
D5  1N4148  [DO-35_BD2.0-L4.0-P8.0-D0.5-RD]  56.5 8.42 180 top
D6  BZT52C3V3  [SOD-123_L2.7-W1.6-LS3.7-RD]  56.25 13.5 180 top
D7  BZT52C3V3  [SOD-123_L2.7-W1.6-LS3.7-RD]  52.06 38.77 0 top
D8  BZT52C3V3  [SOD-123_L2.7-W1.6-LS3.7-RD]  61.07 38.96 0 top
D11  1N5819  [DO-41_BD2.4-L4.7-P8.70-D0.9-RD]  91.43 9.56 270 top
D12  1N5819  [DO-41_BD2.4-L4.7-P8.70-D0.9-RD]  107.17 9.94 270 top
H1  X6511WV-17H-C60D30  [HDR-TH_17P-P2.54-V-M]  -57.55 36.23 0 top
H2  X6511WV-17H-C60D30  [HDR-TH_17P-P2.54-V-M]  -57.16 66.58 0 top
L2  2.2uH  [L1008]  34.28 53.25 0 top
NTC_1  MX35C-8.25-02P-BK01-Cu-S-A  [CONN-TH_MX35C-8.25-02P-BK01-CU-S-A]  29.45 -3.65 0 top
NTC_2  MX35C-8.25-02P-BK01-Cu-S-A  [CONN-TH_MX35C-8.25-02P-BK01-CU-S-A]  54.72 -3.65 0 top
Q2  SS8050-G(RANGE:120-200)  [SOT-23-3_L2.9-W1.3-P1.90-LS2.4-BR]  -10.56 55.66 0 top
Q3  SS8050-G(RANGE:120-200)  [SOT-23-3_L2.9-W1.3-P1.90-LS2.4-BR]  -10.3 50.58 0 top
Q4  2N5551  [TO-92-3_L4.5-W3.5-P1.27-L]  33.13 37.37 0 top
Q5  IRF4905PBF  [TO-220-3_L10.0-W4.5-P2.54-T]  31.61 20.61 90 top
R26  10kΩ  [R0402]  16.72 46.78 0 top
R27  100Ω  [R0402]  36.08 62.41 0 top
R28  10kΩ  [R0402]  -18.3 54.74 0 top
R29  10kΩ  [R0402]  -18.3 51.72 0 top
R30  0Ω  [R0402]  -18.3 48.68 0 top
R31  0Ω  [R0402]  -13.48 45.12 0 top
R32  470Ω  [R0603]  -18.1 45.14 0 top
R33  3.3kΩ  [R0402]  16.37 51.98 0 top
R34  3.3kΩ  [R0402]  15.97 63.92 0 top
R35  3.3kΩ  [R0402]  15.97 55.92 0 top
R36  3.3kΩ  [R0402]  23.35 51.6 0 top
R38  82Ω  [R0402]  71.99 61.22 0 top
R39  82Ω  [R0402]  85.58 59.99 0 top
R41  10kΩ  [R0805]  101.2 8.12 270 top
R42  10kΩ  [R0805]  101.33 12.91 270 top
R43  10kΩ  [R0805]  85.84 7.1 270 top
R44  10kΩ  [R0805]  85.78 12.71 270 top
R45  10kΩ  [R0805]  33.13 44.61 0 top
R46  500kΩ  [R0603]  39.24 37.38 0 top
R47  180Ω  [R0603]  26.91 37.51 0 top
R48  22Ω  [R0402]  -44.47 56.5 0 top
R49  22Ω  [R0402]  -44.47 54.85 0 top
SW7  PTS645SH50SMTR92LFS  [KEY-SMD_4P-L6.0-W6.0-P4.50-LS9.0]  12.05 39.91 0 top
SW9  PTS645SH50SMTR92LFS  [KEY-SMD_4P-L6.0-W6.0-P4.50-LS9.0]  -0.9 39.91 0 top
U1  ESP32-WROOM-32E-N4  [WIFI-SMD_ESP32-WROOM-32E]  -62.12 51.72 0 top
U2  CP2102N-A02-GQFN28R  [QFN-28_L5.0-W5.0-P0.50-TL-EP3.3]  -26.68 53.19 0 top
U5  100kHz  [DIP-8_L9.8-W6.6-P2.54-LS7.6-BL]  56.75 22.39 0 top
U6  TPS63001DRCT  [VSON-10_L3.0-W3.0-P0.50-TL-EP]  42.74 60.69 0 top
U7  74LVC125APW,118  [TSSOP-14_L5.0-W4.4-P0.65-LS6.4-BL]  24.12 58.46 0 top
U8  BH-18650-A5BJ001-2D  [BAT-TH_BH-18650-A5BJ001-2D]  128.13 29.25 90 top
U9  BH-18650-A5BJ001-2D  [BAT-TH_BH-18650-A5BJ001-2D]  153.02 29.25 90 top
U10  ST-0-102-A01-T000-LF  [SW-TH_3P-L8.3-W5.2-P2.54_ST-0-102-A01-T000]  90.28 -5.68 270 top
U11  ST-0-102-A01-T000-LF  [SW-TH_3P-L8.3-W5.2-P2.54_ST-0-102-A01-T000]  103.36 -5.55 270 top
U12  ST-0-102-A01-T000-LF  [SW-TH_3P-L8.3-W5.2-P2.54_ST-0-102-A01-T000]  76.69 -5.68 270 top
USB1  1050170001  [MICRO-USB-SMD_105017-0001]  -25.67 63.92 180 top

## Footprints (pads in the part's own frame, mm; a bottom-side part is the same pattern mirrored in y, then rotated)
BAT-TH_BH-18650-A5BJ001-2D
  round 3.1 hole 2.5: 1(-36.15,0) 2(36.15,0)
C0402
  rect 0.79x0.54 smd: 1(-0.545,0) 2(0.545,0)
C0603
  rect 0.8x0.9 smd: 1(-0.7,0) 2(0.7,0)
C0805
  rect 1.41x1.35 smd: 1(-1,0) 2(1,0)
CONN-TH_MX35C-8.25-02P-BK01-CU-S-A
  round 2.5 hole 1.6: 1(-4.125,0) 2(4.125,0)
DIP-8_L9.8-W6.6-P2.54-LS7.6-BL
  rect 1.5x1.5 hole 0.9: 1(-3.81,-3.81)
  round 1.5 hole 0.9: 2(-1.27,-3.81) 3(1.27,-3.81) 4(3.81,-3.81) 5(3.81,3.81) 6(1.27,3.81) 7(-1.27,3.81) 8(-3.81,3.81)
DO-35_BD2.0-L4.0-P8.0-D0.5-RD
  round 1.6 hole 0.8: 1(-4,0) 2(4,0)
DO-41_BD2.4-L4.7-P8.70-D0.9-RD
  round 1.8 hole 1: 1(-4.35,0) 2(4.35,0)
HDR-TH_17P-P2.54-V-M
  rect 1.6x1.6 hole 1.05: 1(-20.32,0)
  round 1.6 hole 1.05: 2(-17.78,0) 3(-15.24,0) 4(-12.7,0) 5(-10.16,0) 6(-7.62,0) 7(-5.08,0) 8(-2.54,0) 9(0,0) 10(2.54,0) 11(5.08,0) 12(7.62,0) 13(10.16,0) 14(12.7,0) 15(15.24,0) 16(17.78,0) 17(20.32,0)
KEY-SMD_4P-L6.0-W6.0-P4.50-LS9.0
  rect 1.9x1.3 smd: 1(-4.2,2.25) 2(4.2,2.25) 3(-4.2,-2.25) 4(4.2,-2.25)
L1008
  rect 1.635x2.16 smd: 1(-1.167,0) 2(1.167,0)
MICRO-USB-SMD_105017-0001
  rect 0.4x1.3 smd: 1(-1.3,1.33) 2(-0.65,1.33) 3(0,1.33) 4(0.65,1.33) 5(1.3,1.33)
  round 1.35 hole 0.9: 6(-2.5,1.35) 7(2.5,1.35)
  oval 1.2x1.9 hole 0.7x1.4: 8(3.5,-1.35) 9(-3.5,-1.35)
  rect 1.5x1.9 smd: 10(-1,-1.28) 10(1,-1.28)
QFN-28_L5.0-W5.0-P0.50-TL-EP3.3
  rect 0.905x0.28 smd: 1(-2.377,1.5) 2(-2.377,1) 3(-2.377,0.5) 4(-2.377,0) 5(-2.377,-0.5) 6(-2.377,-1) 7(-2.377,-1.5) 15(2.377,-1.5) 16(2.377,-1) 17(2.377,-0.5) 18(2.377,0) 19(2.377,0.5) 20(2.377,1) 21(2.377,1.5)
  rect 0.28x0.905 smd: 8(-1.5,-2.377) 9(-1,-2.377) 10(-0.5,-2.377) 11(0,-2.377) 12(0.5,-2.377) 13(1,-2.377) 14(1.5,-2.377) 22(1.5,2.377) 23(1,2.377) 24(0.5,2.377) 25(0,2.377) 26(-0.5,2.377) 27(-1,2.377) 28(-1.5,2.377)
  rect 3.35x3.35 smd: 29(0,0)
R0402
  rect 0.566x0.54 smd: 1(-0.433,0) 2(0.433,0)
R0603
  rect 0.806x0.864 smd: 1(-0.753,0) 2(0.753,0)
R0805
  rect 1.133x1.377 smd: 1(-1,0) 2(1,0)
SOD-123_L2.7-W1.6-LS3.7-RD
  rect 0.91x1.22 smd: 1(-1.635,0) 2(1.635,0)
SOD-323_L1.8-W1.3-LS2.5-RD
  rect 1x0.75 smd: 1(-1.173,0) 2(1.173,0)
SOD-523_L1.2-W0.8-LS1.6-BI
  rect 0.6x0.4 smd: 1(-0.75,0) 2(0.75,0)
SOT-23-3_L2.9-W1.3-P1.90-LS2.4-BR
  rect 1.25x0.7 smd: 1(1,-0.95) 2(1,0.95) 3(-1,0)
SW-TH_3P-L8.3-W5.2-P2.54_ST-0-102-A01-T000
  oval 1.5x2.5 hole 1x2: 1(-2.54,0) 2(0,0) 3(2.54,0)
TF-SMD_TF-15-15
  rect 1.6x0.701 smd: 1(-5.252,2.45) 2(-5.252,1.35) 3(-5.252,0.25) 4(-5.252,-0.85) 5(-5.252,-1.95) 6(-5.252,-3.05) 7(-5.252,-4.15) 8(-5.252,-5.25) 9(-5.252,-6.35)
  rect 1.6x1.8 smd: 10(-4.399,-8)
  rect 2.4x1.6 smd: 11(5.252,-7.6) 12(5.252,8)
  rect 1.399x1.801 smd: 13(-4.398,7.151)
TO-92-3_L4.5-W3.5-P1.27-L
  rect 1x1.2 hole 0.7x0.85: 1(-1.27,0)
  oval 1x1.2 hole 0.7x0.85: 2(0,0) 3(1.27,0)
TO-220-3_L10.0-W4.5-P2.54-T
  rect 2.5x2 hole 1.3: 1(0,2.54)
  oval 2.5x2 hole 1.3: 2(0,0) 3(0,-2.54)
TSSOP-14_L5.0-W4.4-P0.65-LS6.4-BL
  rect 0.4x1.7 smd: 1(-1.95,-2.8) 2(-1.3,-2.8) 3(-0.65,-2.8) 4(0,-2.8) 5(0.65,-2.8) 6(1.3,-2.8) 7(1.95,-2.8) 8(1.95,2.8) 9(1.3,2.8) 10(0.65,2.8) 11(0,2.8) 12(-0.65,2.8) 13(-1.3,2.8) 14(-1.95,2.8)
VSON-10_L3.0-W3.0-P0.50-TL-EP
  rect 0.8x0.3 smd: 1(-1.5,1) 2(-1.5,0.5) 3(-1.5,0) 4(-1.5,-0.5) 5(-1.5,-1) 6(1.5,-1) 7(1.5,-0.5) 8(1.5,0) 9(1.5,0.5) 10(1.5,1)
  custom 1.52x3.42 smd: 11(0.002,-0.009)
WIFI-SMD_ESP32-WROOM-32E
  rect 0.95x2.1 smd: 1(-9.002,-9) 2(-7.732,-9) 3(-6.463,-9) 4(-5.192,-9) 5(-3.922,-9) 6(-2.652,-9) 7(-1.383,-9) 8(-0.113,-9) 9(1.157,-9) 10(2.428,-9) 11(3.697,-9) 12(4.968,-9) 13(6.237,-9) 14(7.508,-9) 25(7.508,9) 26(6.237,9) 27(4.968,9) 28(3.697,9) 29(2.428,9) 30(1.157,9) 31(-0.113,9) 32(-1.383,9) 33(-2.652,9) 34(-3.922,9) 35(-5.192,9) 36(-6.463,9) 37(-7.732,9) 38(-9.002,9)
  rect 2.1x0.95 smd: 15(9.002,-5.715) 16(9.002,-4.445) 17(9.002,-3.175) 18(9.002,-1.905) 19(9.002,-0.635) 20(9.002,0.635) 21(9.002,1.905) 22(9.002,3.175) 23(9.002,4.445) 24(9.002,5.715)
  rect 0.9x0.9 smd: 39(-2.721,-0.1) 39(-2.721,-1.5) 39(-2.721,-2.9) 39(-1.321,-0.1) 39(-1.321,-1.5) 39(-1.321,-2.9) 39(0.079,-0.1) 39(0.079,-1.5) 39(0.079,-2.9)

## Nets
As in the schematic.

Pads without a net: CARD3 1 8 9; H1 6 7 9 10; H2 3 5 6 9 10 11; U1 17 18 19 20 21 22 32; U2 1 2 9 10 11 12 13 14 15 16 17 18 19 20 21 22 23 27; U5 5; U6 6 7; USB1 4
